# Altium schematic sheet Sheet-NODE-V1.1.SchDoc
size A4; SheetNumber: 1; SheetTotal: 1
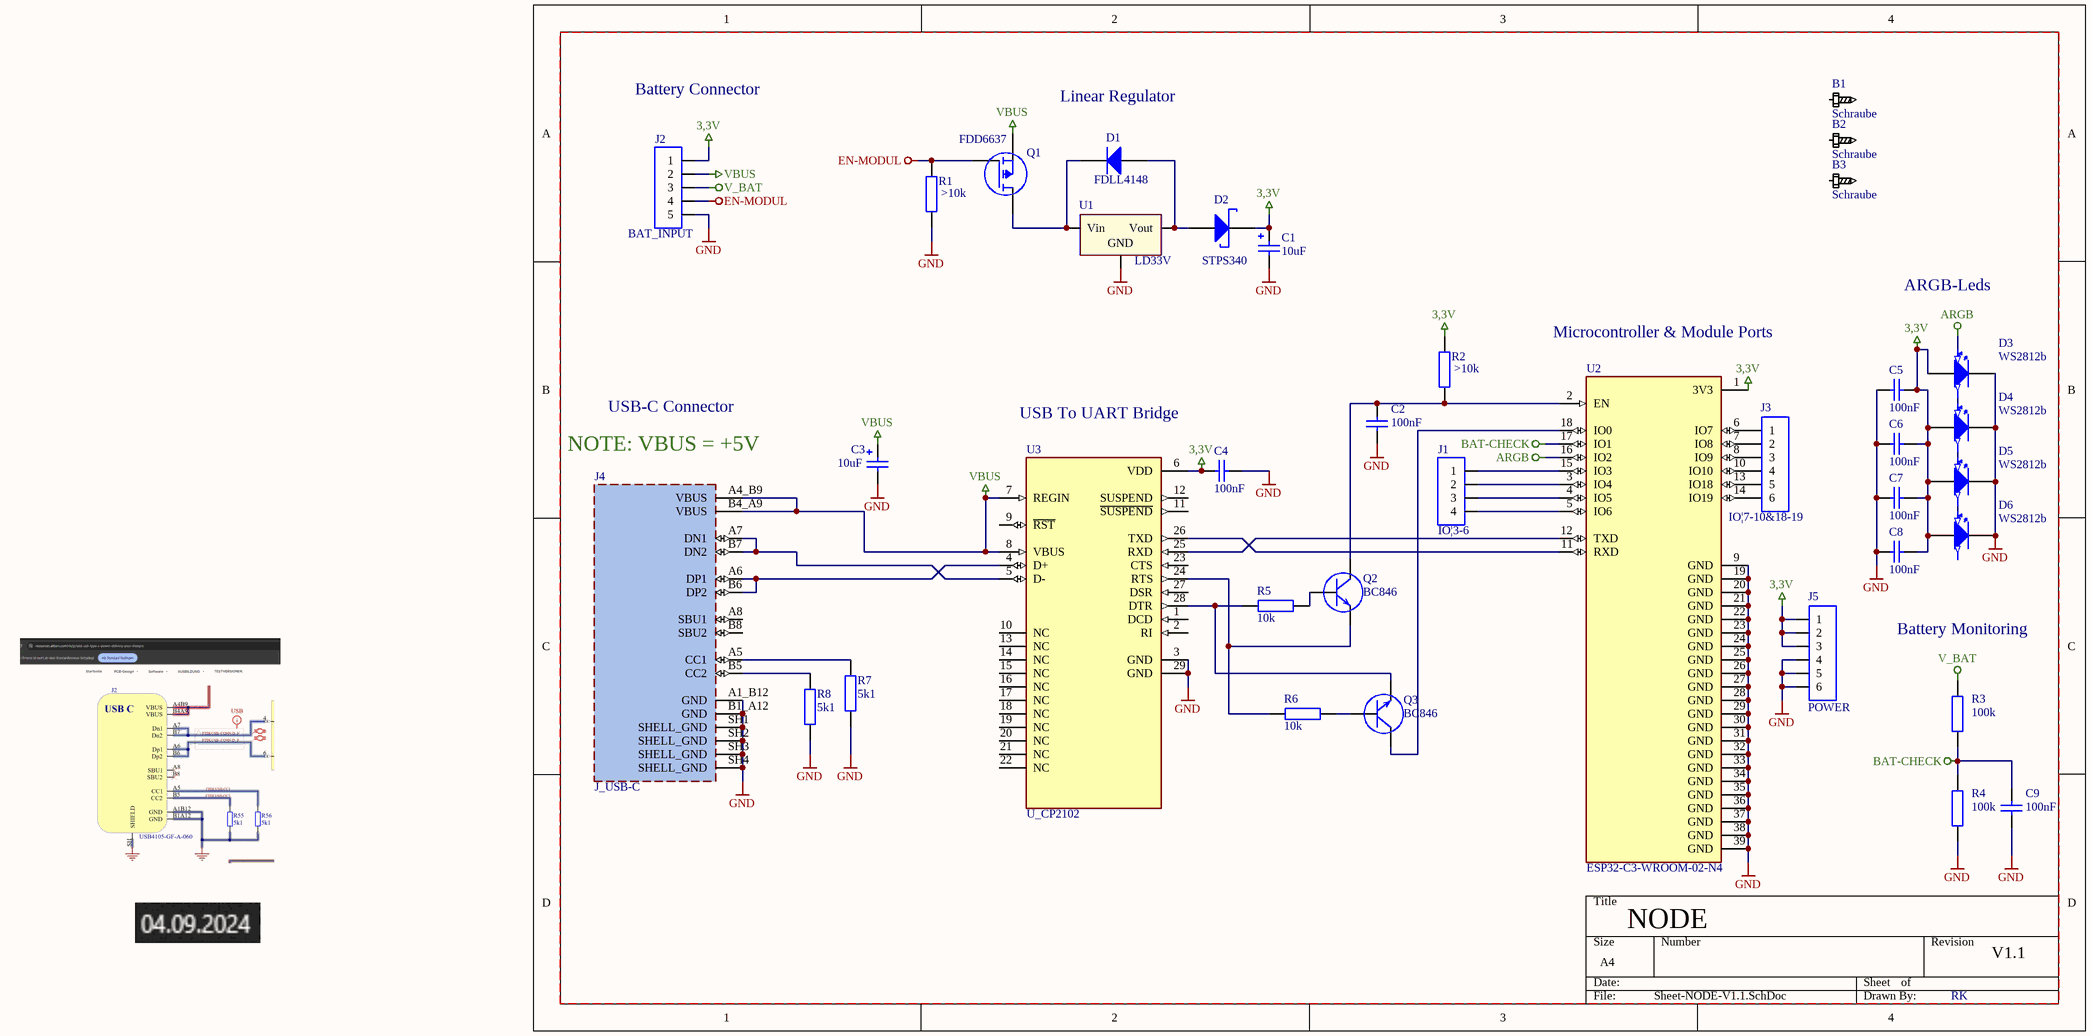
[diagram p0: Sheet-NODE-V1.1.SchDoc]

## Parts
B1  Schraube  [B_Schraube-M3 PAD]
B2  Schraube  [B_Schraube-M3 PAD]
B3  Schraube  [B_Schraube-M3 PAD]
C1  10uF  [C_SMD_B-Typ]
C2  100nF  [C_SMD_0603]
C3  10uF  [C_SMD_B-Typ]
C4  100nF  [C_SMD_0603]
C5  100nF  [C_SMD_0603]
C6  100nF  [C_SMD_0603]
C7  100nF  [C_SMD_0603]
C8  100nF  [C_SMD_0603]
C9  100nF  [C_SMD_0603]
D1  FDLL4148  [SOD-80-2]
D2  STPS340  [D_DO-214]
D3  WS2812b  [D_SMD_LED-ARGB]
D4  WS2812b  [D_SMD_LED-ARGB]
D5  WS2812b  [D_SMD_LED-ARGB]
D6  WS2812b  [D_SMD_LED-ARGB]
J1  IO|3-6  [Sip-4]
J2  BAT_INPUT  [SIP-5]
J3  IO|7-10&18-19  [SIP-6]
J4  J_USB-C  [GCT_USB4105-GF-A]
J5  POWER  [SIP-6]
Q1  FDD6637  [FDD6637_TO-252-3]
Q2  BC846  [SOT-23-3_BC846]
Q3  BC846  [SOT-23-3_BC846]
R1  >10k  [R_SMD_0805]
R2  >10k  [R_SMD_0805]
R3  100k  [R_SMD_0805]
R4  100k  [R_SMD_0805]
R5  10k  [R_SMD_0805]
R6  10k  [R_SMD_0805]
R7  5k1  [R_SMD_0805]
R8  5k1  [R_SMD_0805]
U1  LD33V  [TO-220-3V]
U2  ESP32-C3-WROOM-02-N4  [MODULE_ESP32-C3-WROOM-02-H4]
U3  U_CP2102  [QFN50P500X500X100-29N]

## Nets
3,3V: C1.1 C4.1 C5.2 C6.2 C7.2 C8.2 D2.2(K) D3.1(VDD) D4.1(VDD) D5.1(VDD) D6.1(VDD) J2.1 J5.1 J5.2 J5.3 R2.2 U2.1(3V3) U3.6(VDD)
ARGB: D3.4(DIN) U2.16(IO2)
BAT-CHECK: C9.2 R3.1 R4.2 U2.17(IO1)
EN-MODUL: J2.4 Q1.G R1.2
GND: C1.2 C2.1 C3.2 C4.2 C5.1 C6.1 C7.1 C8.1 C9.1 D3.3(GND) D4.3(GND) D5.3(GND) D6.3(GND) J2.5 J4.A1_B12(GND) J4.B1_A12(GND) J4.SH1(SHELL_GND) J4.SH2(SHELL_GND) J4.SH3(SHELL_GND) J4.SH4(SHELL_GND) J5.4 J5.5 J5.6 R1.1 R4.1 R7.1 R8.1 U1.3(GND) U2.9(GND) U2.19(GND) U2.20(GND) U2.21(GND) U2.22(GND) U2.23(GND) U2.24(GND) U2.25(GND) U2.26(GND) U2.27(GND) U2.28(GND) U2.29(GND) U2.30(GND) U2.31(GND) U2.32(GND) U2.33(GND) U2.34(GND) U2.35(GND) U2.36(GND) U2.37(GND) U2.38(GND) U2.39(GND) U3.3(GND) U3.29(GND)
V_BAT: J2.3 R3.2
VBUS: C3.1 J2.2 J4.A4_B9(VBUS) J4.B4_A9(VBUS) Q1.S U3.7(REGIN) U3.8(VBUS)
NetC2_2: C2.2 Q2.C R2.1 U2.2(EN)
NetD1_1: D1.1(A) D2.1(A) U1.2(Vout)
NetD1_2: D1.2(K) Q1.D U1.1(Vin)
NetD3_2: D3.2(DOUT) D4.4(DIN)
NetD4_2: D4.2(DOUT) D5.4(DIN)
NetD5_2: D5.2(DOUT) D6.4(DIN)
NetJ1_1: J1.1 U2.15(IO3)
NetJ1_2: J1.2 U2.3(IO4)
NetJ1_3: J1.3 U2.4(IO5)
NetJ1_4: J1.4 U2.5(IO6)
NetJ3_1: J3.1 U2.6(IO7)
NetJ3_2: J3.2 U2.7(IO8)
NetJ3_3: J3.3 U2.8(IO9)
NetJ3_4: J3.4 U2.10(IO10)
NetJ3_5: J3.5 U2.13(IO18)
NetJ3_6: J3.6 U2.14(IO19)
NetJ4_A5: J4.A5(CC1) R7.2
NetJ4_A6: J4.A6(DP1) J4.B6(DP2) U3.4(D+)
NetJ4_A7: J4.A7(DN1) J4.B7(DN2) U3.5(D-)
NetJ4_B5: J4.B5(CC2) R8.2
NetQ2_B: Q2.B R5.2
NetQ2_E: Q2.E R6.1 U3.24(RTS)
NetQ3_B: Q3.B R6.2
NetQ3_C: Q3.C U2.18(IO0)
NetQ3_E: Q3.E R5.1 U3.28(DTR)
NetU2_11: U2.11(RXD) U3.26(TXD)
NetU2_12: U2.12(TXD) U3.25(RXD)

Not connected (* = marked no-connect by the designer): B1 1(PAD); B2 1(PAD); B3 1(PAD); D6 2(DOUT); J4 A8(SBU1) B8(SBU2); U3 1(DCD) 2(RI) 9(~{RST}) 10(NC) 11(~{SUSPEND}) 12(SUSPEND) 13(NC) 14(NC) 15(NC) 16(NC) 17(NC) 18(NC) 19(NC) 20(NC) 21(NC) 22(NC) 23(CTS) 27(DSR)

## Notes on the sheet
- Battery Connector
- Linear Regulator
- ARGB-Leds
- (near U2) Microcontroller & Module Ports
- USB-C Connector
- USB To UART Bridge
- (near J4) NOTE: VBUS = +5V
- Battery Monitoring
- NODE
- V1.1
- RK

## Library data of the parts
B1-B3 = B_Schraube: Schraubenloch für M3 Schrauben
C1 C3 = C_SMD_ELK: SMD Elektrolytkondensator; Spannung: *; Bauform: *; Typ: *
C2 C4-C9 = C_SMD_KO: Kondensator SMD Universal, Keramik, Folie, usw.; Spannung: *; Bauform: *; Typ: *
D1 = D_SMD_Silizium: Diode SMD Silizium; Spannung For.: 0,7V; Spannung Rev.: *; Strom: *
D2 = D_SMD_Schottky: Diode SMD Schottky; Spannung Rev.: 0,4V; Spannung For.: *; Strom: *
D3-D6 = D_SMD_LED-ARGB: Diode SMD ARGB
J1 = J_THT_CON4: Stecker
J2 = J_THT_CON5: Stecker
J3 J5 = J_THT_CON6: Stecker
J4 = J_USB-C: USB4105-GF-; MF: {'manufacturer': u'GCT'}; MP: USB4105-GF-A; Package: None; Price: None; Value: *; Availability: Unavailable
Q1 = Q_SMD_MOSFET-P-Kanal: P-Kanal MOSFET; MP: IRFZ44NPBF; MF: Infineon; Check_prices: https://www.snapeda.com/parts/IRFZ44NPBF/Infineon+Technologies/view-part/?ref=eda; Package: TO-220-3 Infineon; SnapEDA_Link: https://www.snapeda.com/parts/IRFZ44NPBF/Infineon+Technologies/view-part/?ref=snap; Value: *; Digi-Key_Part_Number: IRFZ44NPBF-ND; Purchase-URL: https://pricing.snapeda.com/search/part/IRFZ44NPBF/?ref=eda
Q2 Q3 = Q_SMD_NPN: NPN Transistor
R1-R8 = R_SMD_Widerstand: Widerstand SMD
U1 = U_THT_78xx: Linearwandler
U2 = ESP32-C3-WROOM-02-N4: WiFi Modules (802.11) (Engineering Samples) SMD module, ESP32-C3, 4MB SPI flash, PCB antenna, -40 C +85 C; MF: Espressif Systems; Value: *; SnapEDA_Link: https://www.snapeda.com/parts/ESP32-C3-WROOM-02-N4/Espressif+Systems/view-part/?ref=snap; Purchase-URL: https://pricing.snapeda.com/search/part/ESP32-C3-WROOM-02-N4/?ref=eda; Availability: In Stock; Price: None; Package: Package; Check_prices: https://www.snapeda.com/parts/ESP32-C3-WROOM-02-N4/Espressif+Systems/view-part/?ref=eda; MP: ESP32-C3-WROOM-02-N4
U3 = U_CP2102: CP2102N USB 2.0 to UART (RS232) Bridge Interface Evaluation Board; MF: Silicon Labs; MP: CP2102; Purchase-URL: https://pricing.snapeda.com/search/part/CP2102/?ref=eda; Package: WFQFN-20 Silicon Labs; Value: *; Check_prices: https://www.snapeda.com/parts/CP2102/Silicon+Labs/view-part/?ref=eda; SnapEDA_Link: https://www.snapeda.com/parts/CP2102/Silicon+Labs/view-part/?ref=snap; Availability: In Stock; Price: None